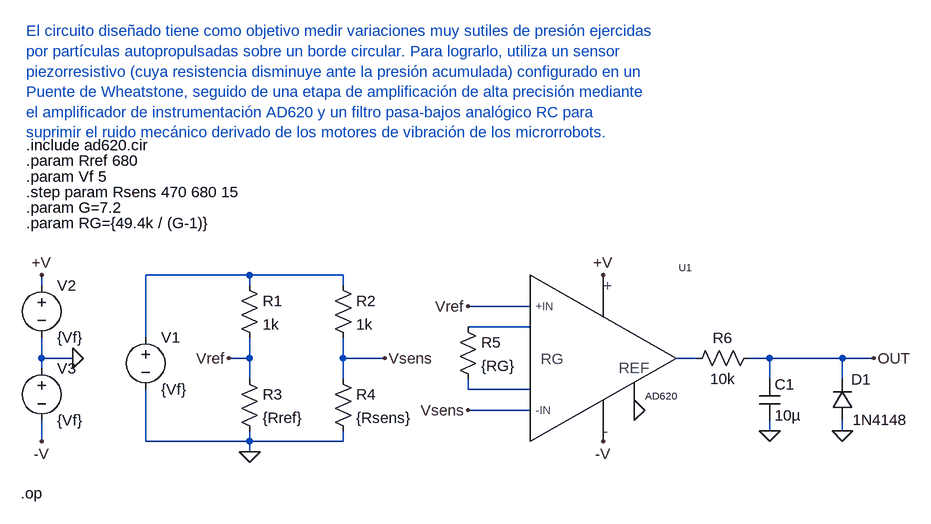
[diagram p0: schematic Draft1.asc]
Draft1.asc, the LTspice schematic file:
Version 4.1
SHEET 1 6016 848
WIRE 240 96 80 96
WIRE 384 96 240 96
WIRE -80 112 -80 96
WIRE 240 112 240 96
WIRE 384 112 384 96
WIRE 672 144 576 144
WIRE 672 176 576 176
WIRE 80 192 80 96
WIRE -80 224 -80 192
WIRE -32 224 -80 224
WIRE 240 224 240 192
WIRE 240 224 208 224
WIRE 384 224 384 192
WIRE 448 224 384 224
WIRE 928 224 896 224
WIRE 1040 224 1008 224
WIRE 1152 224 1040 224
WIRE 1200 224 1152 224
WIRE -80 240 -80 224
WIRE 240 256 240 224
WIRE 384 256 384 224
WIRE 1040 256 1040 224
WIRE 1152 256 1152 224
WIRE 576 272 576 256
WIRE 672 272 576 272
WIRE 672 304 576 304
WIRE 1040 336 1040 320
WIRE 1152 336 1152 320
WIRE -80 352 -80 320
WIRE 80 352 80 272
WIRE 240 352 240 336
WIRE 240 352 80 352
WIRE 384 352 384 336
WIRE 384 352 240 352
WIRE 240 368 240 352
FLAG 240 368 0
FLAG 208 224 Vref
FLAG 448 224 Vsens
FLAG 576 304 Vsens
FLAG 576 144 Vref
FLAG 784 96 +V
FLAG 784 352 -V
FLAG -80 96 +V
FLAG -80 352 -V
FLAG -32 224 0
FLAG 832 304 0
FLAG 1040 336 0
FLAG 1200 224 OUT
FLAG 1152 336 0
SYMBOL res 224 96 R0
SYMATTR InstName R1
SYMATTR Value 1k
SYMBOL res 368 96 R0
SYMATTR InstName R2
SYMATTR Value 1k
SYMBOL res 224 240 R0
SYMATTR InstName R3
SYMATTR Value {Rref}
SYMBOL res 368 240 R0
SYMATTR InstName R4
SYMATTR Value {Rsens}
SYMBOL voltage 80 176 R0
SYMATTR InstName V1
SYMATTR Value {Vf}
SYMBOL AD620 784 224 R0
SYMATTR InstName U1
SYMBOL voltage -80 96 R0
SYMATTR InstName V2
SYMATTR Value {Vf}
SYMBOL voltage -80 224 R0
SYMATTR InstName V3
SYMATTR Value {Vf}
SYMBOL res 560 160 R0
SYMATTR InstName R5
SYMATTR Value {RG}
SYMBOL res 1024 208 R90
WINDOW 0 0 56 VBottom 2
WINDOW 3 32 56 VTop 2
SYMATTR InstName R6
SYMATTR Value 10k
SYMBOL cap 1024 256 R0
SYMATTR InstName C1
SYMATTR Value 10µ
SYMBOL diode 1168 320 R180
WINDOW 0 -28 63 Left 2
WINDOW 3 -85 1 Left 2
SYMATTR InstName D1
SYMATTR Value 1N4148
TEXT -104 -80 Left 2 !.param Rref 680
TEXT -104 -56 Left 2 !.param Vf 5
TEXT -104 -32 Left 2 !.step param Rsens 470 680 15
TEXT -104 -104 Left 2 !.include ad620.cir
TEXT -104 -280 Left 2 ;El circuito diseñado tiene como objetivo medir variaciones muy sutiles de presión ejercidas \npor partículas autopropulsadas sobre un borde circular. Para lograrlo, utiliza un sensor \npiezorresistivo (cuya resistencia disminuye ante la presión acumulada) configurado en un \nPuente de Wheatstone, seguido de una etapa de amplificación de alta precisión mediante \nel amplificador de instrumentación AD620 y un filtro pasa-bajos analógico RC para \nsuprimir el ruido mecánico derivado de los motores de vibración de los microrrobots.
TEXT -104 -8 Left 2 !.param G=7.2
TEXT -112 432 Left 2 !.op
TEXT -104 16 Left 2 !.param RG={49.4k / (G-1)}

The netlist it stands for:
* Draft1.asc
R1 N001 Vref 1k
R2 N001 Vsens 1k
R3 Vref 0 {Rref}
R4 Vsens 0 {Rsens}
V1 N001 0 {Vf}
X§U1 Vref Vsens +V -V N003 0 N002 N004 AD620  ; pins +IN -IN V+ V- OUT REF RG1 RG2
V2 +V 0 {Vf}
V3 0 -V {Vf}
R5 N002 N004 {RG}
R6 OUT N003 10k
C1 OUT 0 10µ
D1 0 OUT 1N4148
.model D D
.lib standard.dio
.param Rref 680
.param Vf 5
.step param Rsens 470 680 15
.include ad620.cir
* El circuito diseñado tiene como objetivo medir variaciones muy sutiles de presión ejercidas
* por partículas autopropulsadas sobre un borde circular. Para lograrlo, utiliza un sensor
* piezorresistivo (cuya resistencia disminuye ante la presión acumulada) configurado en un
* Puente de Wheatstone, seguido de una etapa de amplificación de alta precisión mediante
* el amplificador de instrumentación AD620 y un filtro pasa-bajos analógico RC para
* suprimir el ruido mecánico derivado de los motores de vibración de los microrrobots.
.param G=7.2
.op
.param RG={49.4k / (G-1)}
.lib D:\ITBA\Proyecto_PresionRecintoCircular\Simulacion\ad620.cir
.backanno
.end

* Results of the author's LTspice run, read from the files saved beside the schematic
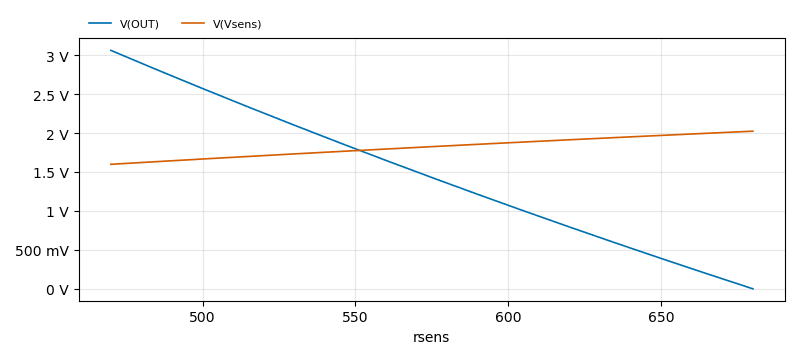
[diagram p1: Operating Point of Draft1.asc, plotted from the saved traces]
* Operating Point, 1 run:
*   V(OUT): 3.062 V at rsens=470 , 370.5 µV at rsens=680 , min 370.5 µV, max 3.062 V
*   V(Vsens): 1.599 V at rsens=470 , 2.024 V at rsens=680 , min 1.599 V, max 2.024 V